# EAGLE design 433hw2 (EAGLE 7.5.0)
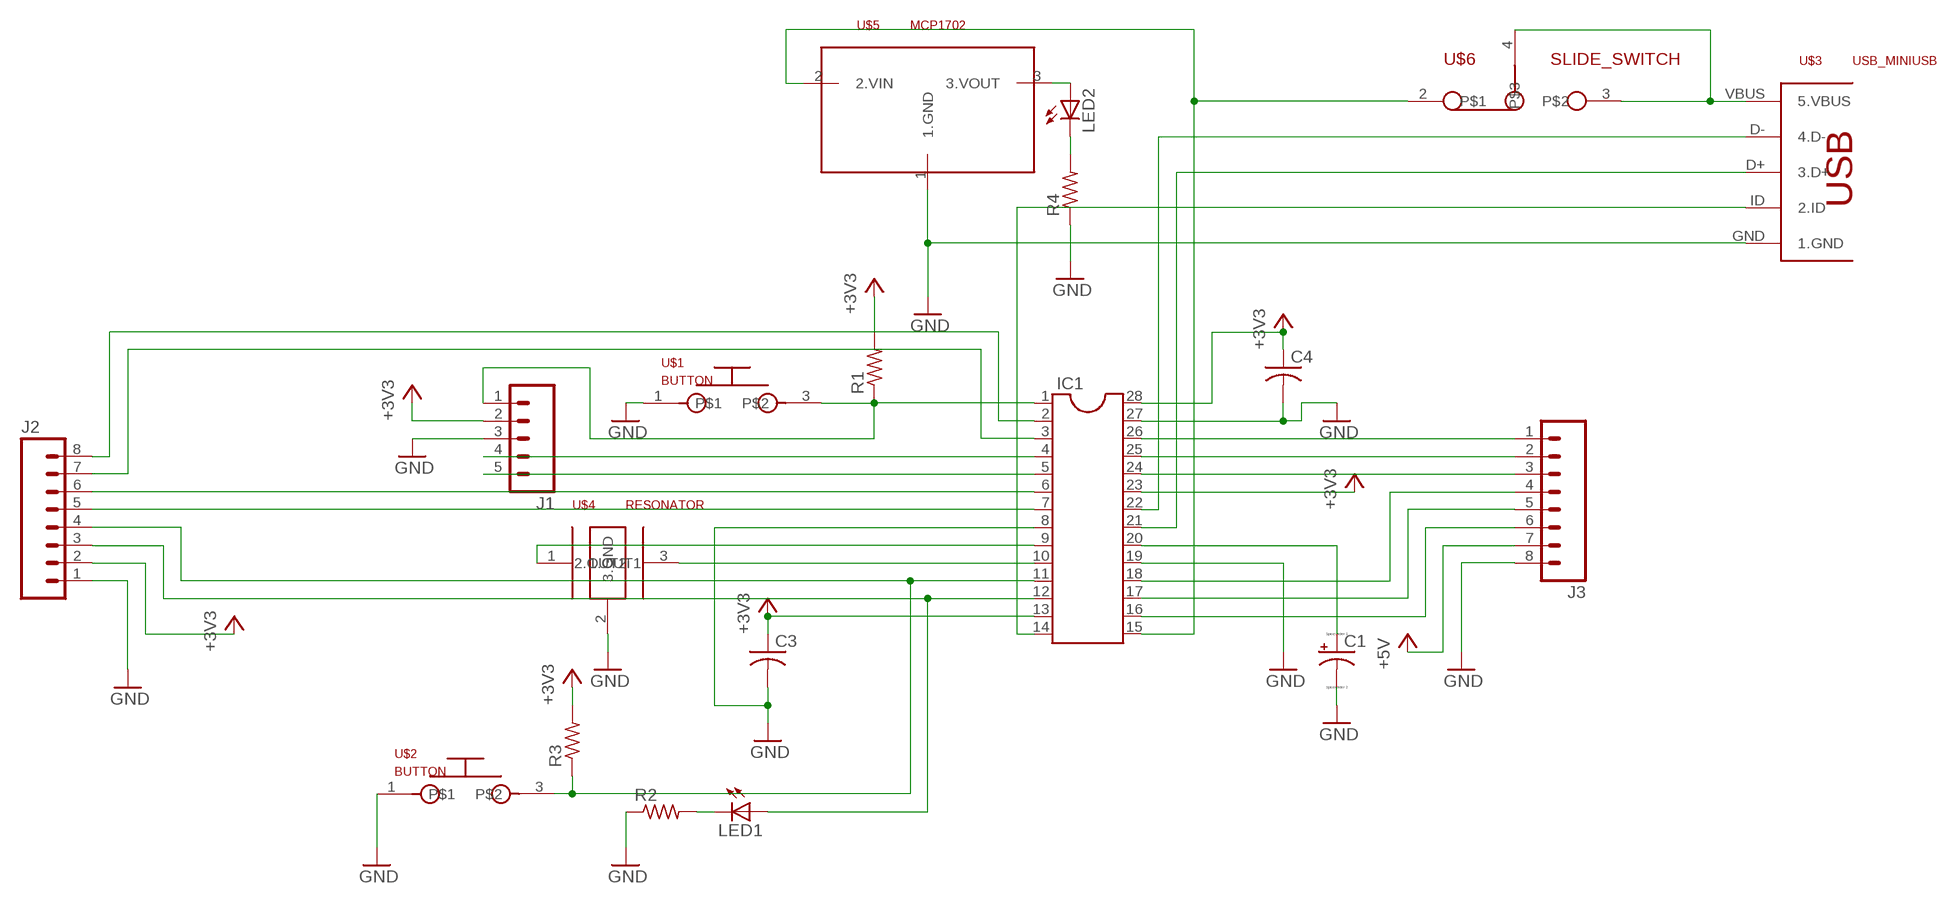
[diagram p0: schematic, sheet 1]

## Parts
C1  CPOL-USE2.5-6  [E2,5-6]
C3  C-US025-025X050  [C025-025X050]
C4  C-US025-025X050  [C025-025X050]
IC1  DIL28-4  [DIL28-4]
J1  M05PTH  [1X05]
J2  M08  [1X08_ROUND]
J3  M08  [1X08_ROUND]
LED1  LED3MM  [LED3MM]
LED2  LED3MM  [LED3MM]
R1  R-US_0207/7  [0207/7]
R2  R-US_0207/7  [0207/7]
R3  R-US_0207/7  [0207/7]
R4  R-US_0207/7  [0207/7]
U$1  BUTTON  [BUTTON]
U$2  BUTTON  [BUTTON]
U$3  USB_MINIUSB  [USB-MB-H]
U$4  RESONATOR  [1X03]
U$5  MCP1702  [TO92]
U$6  SLIDE_SWITCH  [1X05]

## Nets
+3V3: C3.1 C4.1 IC1.13 IC1.23 IC1.28 J1.2 J2.2 R1.2 R3.2
+5V: J3.7
GND: C1.- C3.2 C4.2 IC1.8 IC1.19 IC1.27 J1.3 J2.1 J3.8 R2.1 R4.1 U$1.1 U$2.1 U$3.GND(1.GND) U$4.2(3.GND) U$5.1(1.GND)
N$1: IC1.1 J1.1 R1.1 U$1.3
N$2: IC1.10 U$4.3(2.OUT2)
N$3: IC1.9 U$4.1(1.OUT1)
N$4: IC1.5 J1.5
N$5: LED1.K(C) R2.2
N$6: IC1.12 J2.3 LED1.A
N$7: IC1.4 J1.4
N$8: LED2.A U$5.3(3.VOUT)
N$9: LED2.K(C) R4.2
N$10: IC1.15 U$5.2(2.VIN) U$6.2
N$11: C1.+ IC1.20
N$12: IC1.14 U$3.ID(2.ID)
N$13: IC1.22 U$3.D-(4.D-)
N$14: IC1.21 U$3.D+(3.D+)
N$15: IC1.2 J2.8
N$16: IC1.26 J3.1
N$17: IC1.11 J2.4 R3.1 U$2.3
N$18: IC1.3 J2.7
N$19: IC1.6 J2.6
N$20: IC1.7 J2.5
N$21: IC1.25 J3.2
N$22: IC1.24 J3.3
N$23: IC1.18 J3.4
N$24: IC1.17 J3.5
N$25: IC1.16 J3.6
N$26: U$3.VBUS(5.VBUS) U$6.3 U$6.4

## Library data of the parts
C1 = 433LIB:CPOL-US: POLARIZED CAPACITOR, American symbol
C3 C4 = 433LIB:C-US: CAPACITOR, American symbol
IC1 = 433LIB:DIL28: Dual In Line
J1 = 433LIB:M05: Header 5 Standard 5-pin 0.1" header. Use with straight break away headers (SKU : PRT-00116), right angle break away headers (PRT-00553), swiss pins (PRT-00743), machine pins (PRT-00117), and female headers (PRT-00115). Molex polarized connector foot print use with SKU : PRT-08230 with associated crimp pins and housings.
J2 J3 = 433LIB:M08: Header 8 Standard 8-pin 0.1" header. Use with straight break away headers (SKU : PRT-00116), right angle break away headers (PRT-00553), swiss pins (PRT-00743), machine pins (PRT-00117), and female headers (PRT-00115).; PROD_ID: CONN-08437
LED1 LED2 = 433LIB:LED: LED OSRAM: - CHIPLED LG R971, LG N971, LY N971, LG Q971, LY Q971, LO R971, LY R971 LH N974, LH R974 LS Q976, LO Q976, LY Q976 LO Q996 - Hyper CHIPLED LW Q18S LB Q993, LB Q99A, LB R99A - SideLED LS A670, LO A670, LY A670, LG A670, LP A670 LB A673, LV A673, LT A673, LW A673 LH A674 LY A675 LS A676, LA A676, LO A676, LY A676, LW A676 LS A679, LY A679, LG A679 - Hyper Micro SIDELED® LS Y876, LA Y876, LO Y876, LY Y876 LT Y87S - SmartLED LW L88C, LW L88S LB L89C, LB L89S, LG L890 LS L89K, LO L89K, LY L89K LS L896, LA L896, LO L896, LY L896 - TOPLED LS T670, LO T670, LY T670, LG T670, LP T670 LSG T670, LSP T670, LSY T670, LOP T670, LYG T670 LG T671, LOG T671, LSG T671 LB T673, LV T673, LT T673, LW T673 LH T674 LS T676, LA T676, LO T676, LY T676, LB T676, LH T676, LSB T676, LW T676 LB T67C, LV T67C, LT T67C, LS T67K, LO T67K, LY T67K, LW E67C LS E67B, LA E67B, LO E67B, LY E67B, LB E67C, LV E67C, LT E67C LW T67C LS T679, LY T679, LG T679 LS T770, LO T770, LY T770, LG T770, LP T770 LB T773, LV T773, LT T773, LW T773 LH T774 LS E675, LA E675, LY E675, LS T675 LS T776, LA T776, LO T776, LY T776, LB T776 LHGB T686 LT T68C, LB T68C - Hyper Mini TOPLED® LB M676 - Mini TOPLED Santana® LG M470 LS M47K, LO M47K, LY M47K Source: http://www.osram.convergy.de LUXEON: - LUMILED® LXK2-PW12-R00, LXK2-PW12-S00, LXK2-PW14-U00, LXK2-PW14-V00 LXK2-PM12-R00, LXK2-PM12-S00, LXK2-PM14-U00 LXK2-PE12-Q00, LXK2-PE12-R00, LXK2-PE12-S00, LXK2-PE14-T00, LXK2-PE14-U00 LXK2-PB12-K00, LXK2-PB12-L00, LXK2-PB12-M00, LXK2-PB14-N00, LXK2-PB14-P00, LXK2-PB14-Q00 LXK2-PR12-L00, LXK2-PR12-M00, LXK2-PR14-Q00, LXK2-PR14-R00 LXK2-PD12-Q00, LXK2-PD12-R00, LXK2-PD12-S00 LXK2-PH12-R00, LXK2-PH12-S00 LXK2-PL12-P00, LXK2-PL12-Q00, LXK2-PL12-R00 Source: www.luxeon.com KINGBRIGHT: KA-3528ASYC Source: www.kingbright.com
R1-R4 = 433LIB:R-US_: RESISTOR, American symbol
U$1 U$2 = 433LIB:BUTTON
U$3 = 433LIB:USB_MINI
U$4 = 433LIB:RESONATOR
U$5 = 433LIB:MCP1702
U$6 = 433LIB:SLIDE_SWITCH

## Board
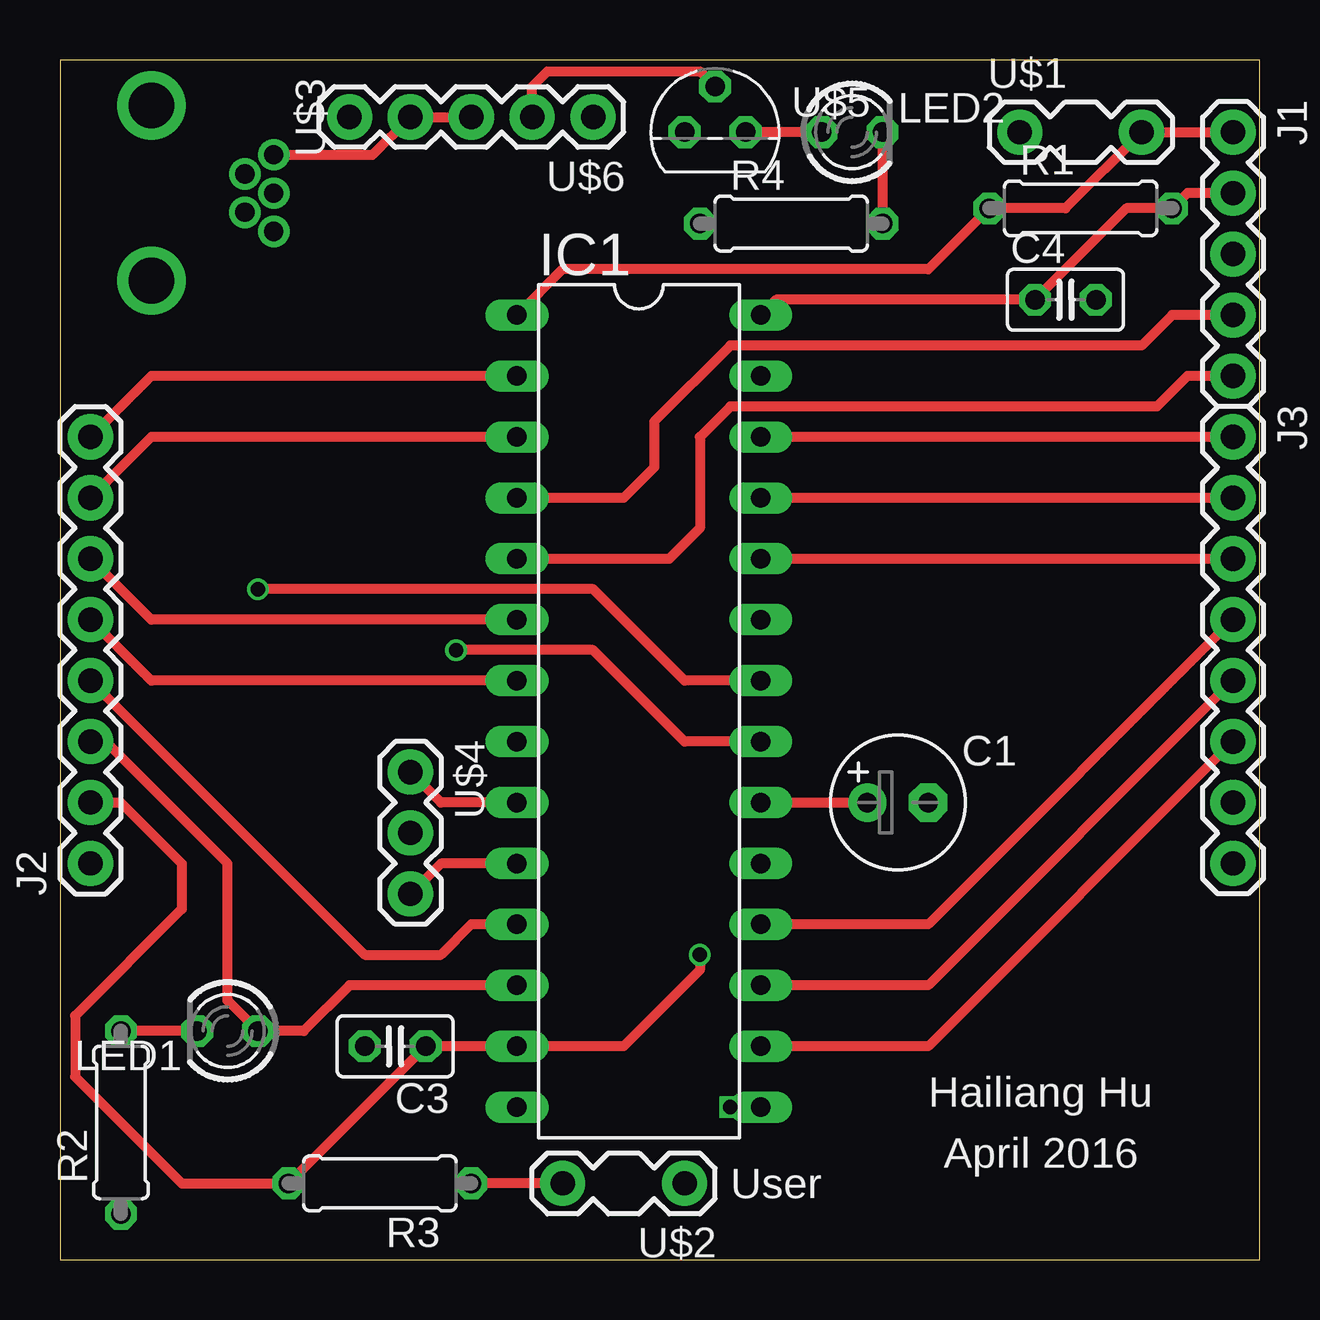
[diagram p1: board, top side]
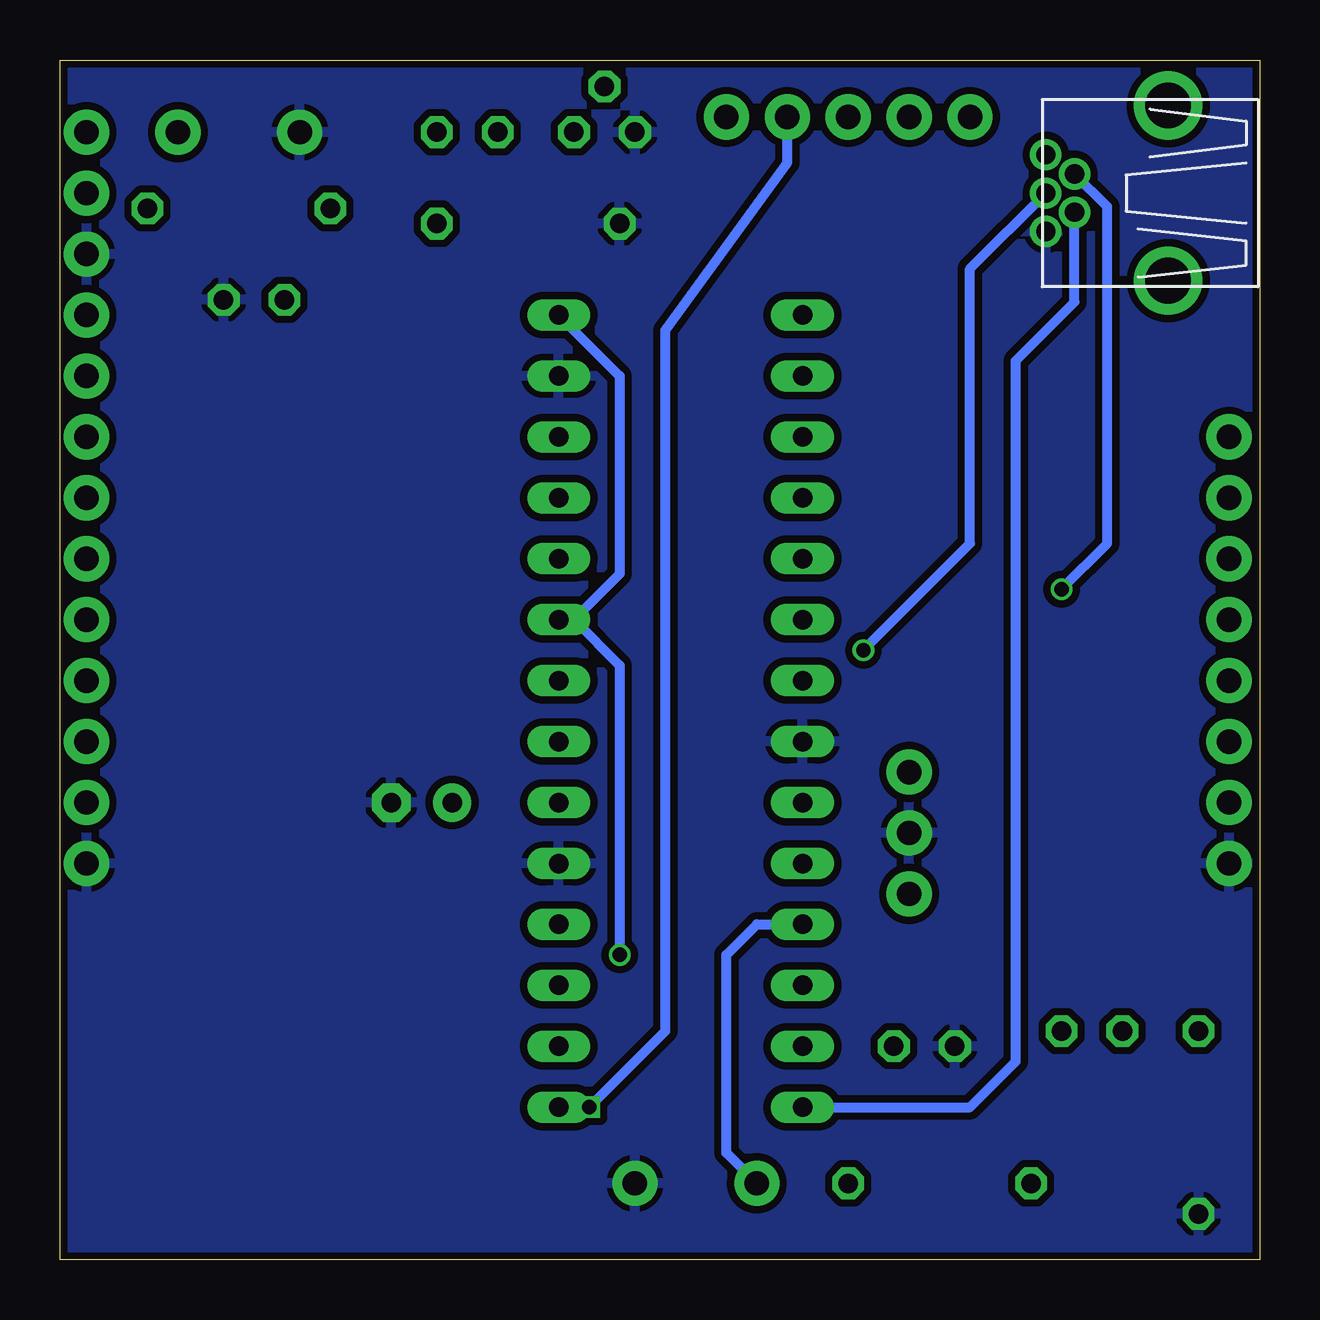
[diagram p2: board, bottom side, seen from below]

Size 50 x 50 mm. Coordinates in mm from the lower left corner, seen from the top.
Outline: 0,0 50,0 50,50 0,50 0,0
Copper layers (1*16): Top 0.035mm / dielectric 1.5mm / Bottom 0.035mm
Design rules "SeeedStudio_2layer_DRU_no_angle_20140221": minimum track width 6mil, minimum drill 12mil, track to track 6mil, track to pad 6mil, pad to pad 6mil, via to via 6mil, smd to smd 0mil, copper to edge 10mil, drill to drill 10mil, minimum pad ring 10mil, minimum via ring 6mil, stop-mask expansion 2mil, vias tented up to drill 100mil, thermal gap 10mil

### Footprints (pad centres in the part's own frame; a part is rotated, then mirrored left to right if it is on the bottom)
E2,5-6 = drill 0.813 pad 1.6: + -1.27,0 | drill 0.813 pad 1.6 octagon: - 1.27,0
C025-025X050 = drill 0.813 octagon: 1 -1.27,0; 2 1.27,0
DIL28-4 = drill 0.813 long: 1 -16.51,-5.08; 2 -13.97,-5.08; 3 -11.43,-5.08; 4 -8.89,-5.08; 5 -6.35,-5.08; 6 -3.81,-5.08; 7 -1.27,-5.08; 8 1.27,-5.08; 9 3.81,-5.08; 10 6.35,-5.08; 11 8.89,-5.08; 12 11.43,-5.08; 13 13.97,-5.08; 14 16.51,-5.08; 15 16.51,5.08; 16 13.97,5.08; 17 11.43,5.08; 18 8.89,5.08; 19 6.35,5.08; 20 3.81,5.08; 21 1.27,5.08; 22 -1.27,5.08; 23 -3.81,5.08; 24 -6.35,5.08; 25 -8.89,5.08; 26 -11.43,5.08; 27 -13.97,5.08; 28 -16.51,5.08
1X05 = drill 1.016 pad 1.88: 1 0,0; 2 2.54,0; 3 5.08,0; 4 7.62,0; 5 10.16,0
1X08_ROUND = drill 1.016 pad 1.88: 1 0,0; 2 2.54,0; 3 5.08,0; 4 7.62,0; 5 10.16,0; 6 12.7,0; 7 15.24,0; 8 17.78,0
LED3MM = drill 0.813 octagon: A -1.27,0; K 1.27,0
0207/7 = drill 0.813 octagon: 1 -3.81,0; 2 3.81,0
BUTTON = drill 1.016 pad 1.88: 1 0,0; 3 5.08,0
USB-MB-H = drill 0.8: D+ 5.1,0; D- 3.9,0.8; GND 5.1,-1.6; ID 3.9,-0.8; VBUS 5.1,1.6 | drill 1.9: P$6 0,-3.65; P$7 0,3.65
1X03 = drill 1.016 pad 1.88: 1 0,0; 2 2.54,0; 3 5.08,0
TO92 = drill 0.813 octagon: 1 -1.27,0; 2 0,1.905; 3 1.27,0

### Placement (x,y rotation side)
C1  34.92,19.05 0 top
C3  13.97,8.89 180 top
C4  41.91,40.01 0 top
IC1  24.13,22.86 270 top
J1  48.9,46.99 270 top
J2  1.27,16.51 90 top
J3  48.9,34.29 270 top
LED1  6.99,9.53 180 top
LED2  33.02,46.99 0 top
R1  42.55,43.81 0 top
R2  2.54,5.71 90 top
R3  13.34,3.17 180 top
R4  30.48,43.18 0 top
U$1  40.01,46.99 0 top
U$2  26.04,3.17 180 top
U$3  3.81,44.45 0 top
U$4  14.61,20.32 270 top
U$5  27.3,46.99 0 top
U$6  22.23,47.62 180 top

### Tracks (layer width: path | path; a pad name or v marks a point on that pad's centre or on a via)
+3V3  (via drill 0.6)
  Top 0.406: J1.2 46.99,44.45 R1.2 44.45,43.81 C4.1 29.84,40.01 IC1.28 | J2.2 2.54,19.05 5.08,16.51 5.08,14.61 0.64,10.16 0.64,7.62 5.08,3.17 R3.2 C3.1 IC1.13 23.5,8.89 26.67,12.06 v26.67,12.7
  Bottom 0.406: IC1.28 26.67,36.83 26.67,28.57 28.57,26.67 | 28.57,26.67 IC1.23 | 28.57,26.67 26.67,24.77 v26.67,12.7
GND
  pour Bottom (isolate 0.305): 0,0 49.53,0 49.53,49.53 0,49.53
N$1
  Top 0.406: J1.1 U$1.3 41.91,43.81 R1.1 36.2,41.27 20.95,41.27 IC1.1
N$2
  Top 0.406: IC1.10 15.88,16.51 U$4.3
N$3
  Top 0.406: IC1.9 15.88,19.05 U$4.1
N$4
  Top 0.406: IC1.5 25.4,29.21 26.67,30.48 26.67,34.29 27.94,35.56 45.72,35.56 46.99,36.83 J1.5
N$5
  Top 0.406: LED1.K R2.2
N$6
  Top 0.406: J2.3 1.91,21.59 6.99,16.51 6.99,10.79 LED1.A 10.16,9.53 12.06,11.43 IC1.12
N$7
  Top 0.406: J1.4 46.35,39.37 45.09,38.1 27.94,38.1 24.77,34.92 24.77,33.02 23.5,31.75 IC1.4
N$8
  Top 0.406: LED2.A U$5.3
N$9
  Top 0.406: LED2.K R4.2
N$10  (via drill 0.6)
  Top 0.406: IC1.15 v27.94,6.35 | U$6.2 19.68,48.9 20.32,49.53 26.67,49.53 U$5.2
  Bottom 0.406: v27.94,6.35 24.77,9.53 24.77,38.73 19.68,45.72 U$6.2
N$11
  Top 0.406: IC1.20 C1.+
N$12
  Bottom 0.406: IC1.14 12.06,6.35 10.16,8.26 10.16,37.47 7.71,39.91 U$3.ID
N$13  (via drill 0.6)
  Top 0.406: IC1.22 26.04,24.13 22.23,27.94 v8.26,27.94
  Bottom 0.406: v8.26,27.94 6.35,29.84 6.35,43.89 U$3.D-
N$14  (via drill 0.6)
  Top 0.406: IC1.21 26.04,21.59 22.23,25.4 v16.51,25.4
  Bottom 0.406: v16.51,25.4 12.06,29.84 12.06,41.3 U$3.D+
N$15
  Top 0.406: IC1.2 3.81,36.83 J2.8
N$16
  Top 0.406: J3.1 IC1.26
N$17
  Top 0.406: IC1.11 17.14,13.97 15.88,12.7 12.7,12.7 J2.4 | U$2.3 R3.1
  Bottom 0.406: U$2.3 22.23,4.45 22.23,12.7 20.95,13.97 IC1.11
N$18
  Top 0.406: IC1.3 3.81,34.29 J2.7
N$19
  Top 0.406: IC1.6 3.81,26.67 J2.6
N$20
  Top 0.406: IC1.7 3.81,24.13 J2.5
N$21
  Top 0.406: J3.2 IC1.25
N$22
  Top 0.406: IC1.24 J3.3
N$23
  Top 0.406: J3.4 36.2,13.97 IC1.18
N$24
  Top 0.406: J3.5 36.2,11.43 IC1.17
N$25
  Top 0.406: J3.6 36.2,8.89 IC1.16
N$26
  Top 0.406: U$3.VBUS 13.03,46.05 U$6.4 U$6.3

### Text on the board
tPlace: Hailiang Hu | April 2016 | User